# Altium schematic sheet BuckReg.SchDoc
size Letter; Author: Adam Gilbert; CompanyName: McGill University; DrawnBy: Adam Gilbert; Organization: Altium Limited; Address1: McGill Cosmology; Address2: 3600 University Street; Address3: Montreal, Quebec; Address4: Canada; DocumentNumber: 3; Revision: Rev2; SheetNumber: 3; SheetTotal: 16; ProjectTitle: DfMux FMC Mezz; ModelNumber: MGMEZZ04; ProjectName: DfMux FMC Mezz
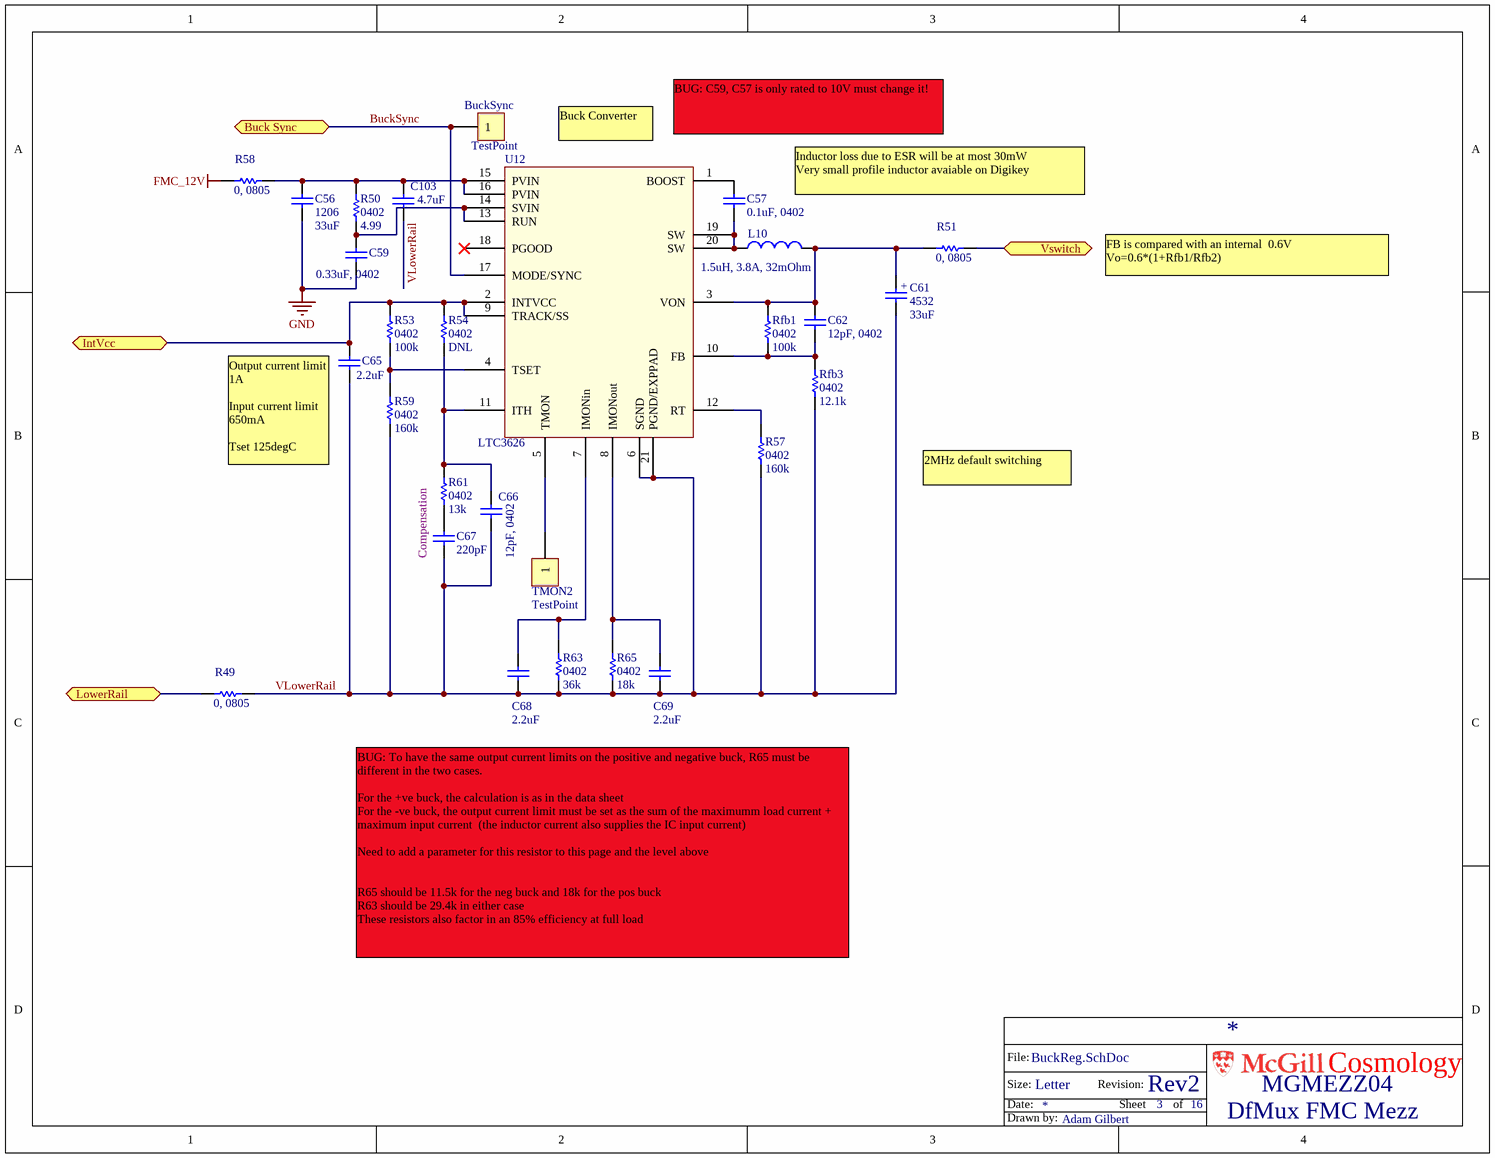
[diagram p0: BuckReg.SchDoc]

## Parts
BuckSync  TestPoint  [TP-3520-SK]  (no BOM)
C56  Footprint: 1206  [CC3225-1210]  (hidden comment: 33uF)
C57  0.1uF, 0402  [0402]
C59  0.33uF, 0402  [0402]
C61  Footprint: 4532  [TANT4532]  (hidden comment: 33uF)
C62  12pF, 0402  [0402]
C65  2.2uF  [0603]
C66  12pF, 0402  [0402]
C67  220pF  [0603]
C68  2.2uF  [0603]
C69  2.2uF  [0603]
C103  4.7uF  [0603]
L10  Part Constraints: 1.5uH, 3.8A, 32mOhm  [IHLP-1212]  (hidden comment: 1.5uH)
R49  0, 0805  [0805]
R50  4.99  [0402]
R51  0, 0805  [0805]
R53  100k  [0402]
R54  DNL  [0402]
R57  160k  [0402]
R58  0, 0805  [0805]
R59  160k  [0402]
R61  13k  [0402]
R63  36k  [0402]
R65  18k  [0402]
Rfb1  100k  [0402]
Rfb3  12.1k  [0402]
TMON2  TestPoint  [TP-3520-SK]  (no BOM)
U12  LTC3626  [LTC3626]

## Ports
Buck Sync, IntVcc, LowerRail, Vswitch

## Nets
FMC_12V: R58.2
GND: C56.2 C59.1
BuckSync: BuckSync.1 U12.17(MODE/SYNC) ; port Buck Sync
IntVcc: C65.2 R53.1 R54.1 U12.2(INTVCC) U12.9(TRACK/SS) ; port IntVcc
LowerRail: R49.2 ; port LowerRail
VLowerRail: C61.2 C65.1 C66.1 C67.2 C68.2 C69.2 C103.2 R49.1 R57.2 R59.2 R63.2 R65.2 Rfb3.2 U12.6(SGND) U12.21(PGND/EXPPAD)
Vswitch: R51.1 ; port Vswitch
NetC56_1: C56.1 C103.1 R50.1 R58.1 U12.15(PVIN) U12.16(PVIN)
NetC57_1: C57.1 L10.1 U12.19(SW) U12.20(SW)
NetC57_2: C57.2 U12.1(BOOST)
NetC59_2: C59.2 R50.2 U12.13(RUN) U12.14(SVIN)
NetC61_1: C61.1 C62.2 L10.2 R51.2 Rfb1.1 U12.3(VON)
NetC62_1: C62.1 Rfb1.2 Rfb3.1 U12.10(FB)
NetC66_2: C66.2 R54.2 R61.1 U12.11(ITH)
NetC67_1: C67.1 R61.2
NetC68_1: C68.1 R63.1 U12.7(IMONin)
NetC69_1: C69.1 R65.1 U12.8(IMONout)
NetR53_2: R53.2 R59.1 U12.4(TSET)
NetR57_1: R57.1 U12.12(RT)
NetTMON2_1: TMON2.1 U12.5(TMON)

Not connected (* = marked no-connect by the designer): U12 18(PGOOD)*

## Notes on the sheet
- (near U12) Buck Converter
- BUG: C59, C57 is only rated to 10V must change it!
- Inductor loss due to ESR will be at most 30mW
  Very small profile inductor avaiable on Digikey
- FB is compared with an internal  0.6V
  Vo=0.6*(1+Rfb1/Rfb2)
- (near C65) Output current limit 1A
  Input current limit 650mA
  Tset 125degC
- 2MHz default switching
- Compensation
- BUG: To have the same output current limits on the positive and negative buck, R65 must be different in the two cases.
  For the +ve buck, the calculation is as in the data sheet
  For the -ve buck, the output current limit must be set as the sum of the maximumm load current + maximum input current  (the inductor current also supplies the IC input current)
  Need to add a parameter for this resistor to this page and the level above
  R65 should be 11.5k for the neg buck and 18k for the pos buck
  R63 should be 29.4k in either case
  These resistors also factor in an 85% efficiency at full load
- File:
- Size:
- Date:
- Letter
- Revision:
- Sheet
- of
- Cosmology
- Drawn by:
- (in symbol CAP4532) +

## Library data of the parts
BuckSync TMON2 = TestPoint: TestPoint1; Assembly Comments: none; Footprint: *
C56 = CAP 1210: Capacitor, Ceramic, 1210; Manufacturer: TDK Corporation; Part Constraints: 33uF or 47uF  (1206 or 1210) 25V X5R; Manufacturer Part Number 1: C3216X5R1E336M; Assembly Comments: none; Temperature Coefficient: X5R; Value: 33uF; Supplier 1: Digi-Key; Supplier Part Number 1: 445-8046-1-ND; Operating Temperature: -55°C ~ 85°C; Packaging: Cut Tape (CT)
C57 = CAP 0603: Capacitor, Ceramic, 0402; Part Constraints: 10% 10V X5R 0402; Manufacturer: TDK Corporation; Manufacturer Part Number 1: C1005X5R1A104K050BA; Temperature Coefficient: X5R; Assembly Comments: none; Value: 0.1uF, 0402; Supplier 1: Digi-Key; Supplier Part Number 1: 445-1265-1-ND; Operating Temperature: -55°C ~ 85°C; Thickness (Max): 0.022" (0.55mm); Packaging: Cut Tape (CT)
C59 = CAP 0603: Capacitor, Ceramic, 0402; Part Constraints: 10% 10V X5R 0402; Manufacturer: TDK Corporation; Manufacturer Part Number 1: C1005X5R1A334K050BB; Temperature Coefficient: X5R; Assembly Comments: none; Value: 0.33uF, 0402; Operating Temperature: -55°C ~ 85°C; Thickness (Max): 0.022" (0.55mm); Packaging: Cut Tape (CT); Supplier 1: Digi-Key; Supplier Part Number 1: 445-4987-6-ND
C61 = CAP4532: 33u, 16V, 20%, 4532C, X5R; Manufacturer: TDK Corporation; Manufacturer Part Number 1: C4532X5R1C336M; Assembly Comments: none; Part Constraints: 33u, 16V, 20%, 4532C, X5R; Supplier 1: Digi-Key; Supplier Part Number 1: 445-1443-1-ND; Value: 33uF; Operating Temperature: -55°C ~ 85°C; Packaging: Cut Tape (CT); Temperature Coefficient: X5R
C62 C66 = CAP 0402: Capacitor, Ceramic, 0402; Part Constraints: 10% 16V X7R 0402; Manufacturer: Generic; Assembly Comments: none; Value: 12pF, 0402; Manufacturer Part Number 1: Generic
C65 = CAP 0603: Capacitor, Ceramic, 0603; Part Constraints: 10% 10V X5R 0603; Manufacturer: Generic; Assembly Comments: none; Value: 2.2uF; Manufacturer Part Number 1: Generic
C67 = CAP 0603: Capacitor, Ceramic, 0603; Part Constraints: 10% 16V X7R 0603; Manufacturer: Generic; Assembly Comments: none; Value: 220pF; Manufacturer Part Number 1: Generic
C68 C69 = CAP 0603: Capacitor, Ceramic, 0603; Part Constraints: 10% 6.3V X5R 0603; Manufacturer: TDK Corporation; Manufacturer Part Number 1: C1608X5R0J225K080AB; Assembly Comments: none; Temperature Coefficient: X5R; Value: 2.2uF; Supplier 1: Digi-Key; Supplier Part Number 1: 445-5175-1-ND; Operating Temperature: -55°C ~ 85°C; Thickness (Max): 0.037" (0.95mm); Packaging: Cut Tape (CT)
C103 = CAP 0603: Capacitor, Ceramic, 0603; Part Constraints: 10% 35V X5R 0603; Manufacturer: Murata Electronics North America; Manufacturer Part Number 1: GRM188R6YA475KE15D; Assembly Comments: none; Value: 4.7uF
L10 = IND IHLP1212: Inductor IHLP1212; Manufacturer: Vishay Dale; Manufacturer Part Number 1: IHLP1212BZER1R5M11; Assembly Comments: none; Footprint: IHLP1212; Value: 1.5uH; Supplier 1: Digi-Key; Supplier Part Number 1: 541-1321-1-ND
R49 R51 R58 = Res1812: RES 0.0 OHM 1/8W 0805 SMD; Manufacturer: e.g Vishay/Dale; Part constraints: 0Ohm jumper, >=4A, 0805, <=5mOhms; Manufacturer Part Number 1: e.g CRCW08050000Z0EAHP; Value: 0; Assembly Comments: none; Supplier 1: Newark; Supplier Part Number 1: 68R2993
R50 R53 R54 R57 R59 R61 R63 R65 Rfb1 Rfb3 = RES 0402: Resistor; Manufacturer: Generic; Part Constraints: 1% 1/10W 100ppm 0402; Assembly Comments: none; Manufacturer Part Number 1: Generic
  R50: Value: 4.99
  R53 Rfb1: Value: 100k
  R54: Value: DNL
  R57 R59: Value: 160k
  R61: Value: 13k
  R63: Value: 36k
  R65: Value: 18k
  Rfb3: Value: 12.1k
U12 = LTC3626: 20V, 2.5A Sync buck, 3Mhz; Part Constraints: LTC3626EUDC#PBF; Manufacturer: Linear Technology; Assembly Comments: none; Supplier 1: Digi-Key; Supplier Part Number 1: LTC3626EUDC#PBF-ND; Manufacturer Part Number 1: LTC3626EUDC#PBF